# Altium schematic sheet E-26 Temp Sensor.SchDoc: E-26 Tempature Sensor
size B; DrawnBy: Jeremie Boulianne; Organization: Synthiam Inc.; Address1: Unit 10, 6120 - 11 St. SE; Address2: Calgary, AB; Address3: T2H 2L7; Address4: Canada
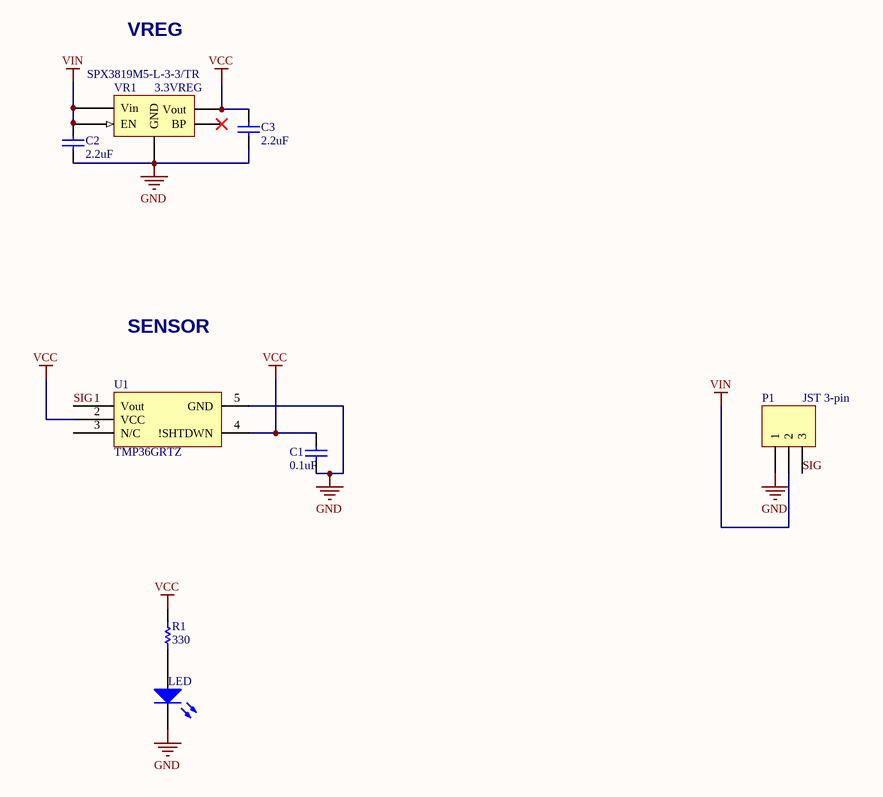
[diagram p0: E-26 Temp Sensor.SchDoc]

## Parts
C1  value 0.1uF  [0805 TIGHT]  (hidden comment: 18pF)
C2  2.2uF  [0805 TIGHT]
C3  value 2.2uF  [0805 TIGHT]  (hidden comment: 100nF)
LED  LED2  [0805 LED - TIGHT]  (value not drawn)
P1  JST 3-pin  [JST-PH 3-pin SMD]
R1  value 330  [0805 TIGHT]  (hidden comment: Res1)
U1  TMP36GRTZ  [SOT-23-5]
VR1  3.3VREG  [SOT-25 New]

## Nets
GND: C1.1 C2.2 C3.2 LED.2(K) P1.1 U1.5(GND) VR1.3(GND)
VCC: C1.2 C3.1 R1.2 U1.2(VCC) U1.4(!SHTDWN) VR1.2(Vout)
VIN: C2.1 P1.2 VR1.4(EN) VR1.5(Vin)
SIG: P1.3 U1.1(Vout)
NetLED_1: LED.1(A) R1.1

Not connected (* = marked no-connect by the designer): U1 3(N/C); VR1 1(BP)*

## Notes on the sheet
- VREG
- SENSOR
- Labels drawn without touching a wire or pin: SPX3819M5-L-3-3/TR
- Property of:
- Size:
- Date:
- B
- Drawn By:
- Time:
- Revision:
- Copyright © 2019 Synthiam Inc. All rights reserved.

## Library data of the parts
C1-C3 = Cap: Capacitor; Published: 8-Jun-2000; LatestRevisionDate: 17-Jul-2002; LatestRevisionNote: Re-released for DXP Platform.; PackageReference: RAD-0.3; Publisher: Altium Limited
  C2: Value: 2.2uF
LED = LED1: Typical RED GaAs LED; Published: 8-Jun-2000; LatestRevisionDate: 08-Jul-2005; LatestRevisionNote: Mech Layer 1 removed.; PackageReference: LED-1; Publisher: Altium Limited
P1 = Header 3: Header, 3-Pin; LatestRevisionDate: 17-Jul-2002; LatestRevisionNote: Re-released for DXP Platform.; Publisher: Altium Limited
R1 = Res1: Resistor; Published: 8-Jun-2000; LatestRevisionDate: 17-Jul-2002; LatestRevisionNote: Re-released for DXP Platform.; PackageReference: AXIAL-0.3; Publisher: Altium Limited
U1 = TMP36
VR1 = Vreg SOT25